# EAGLE schematic STELLA_RF (EAGLE 9.6.2)
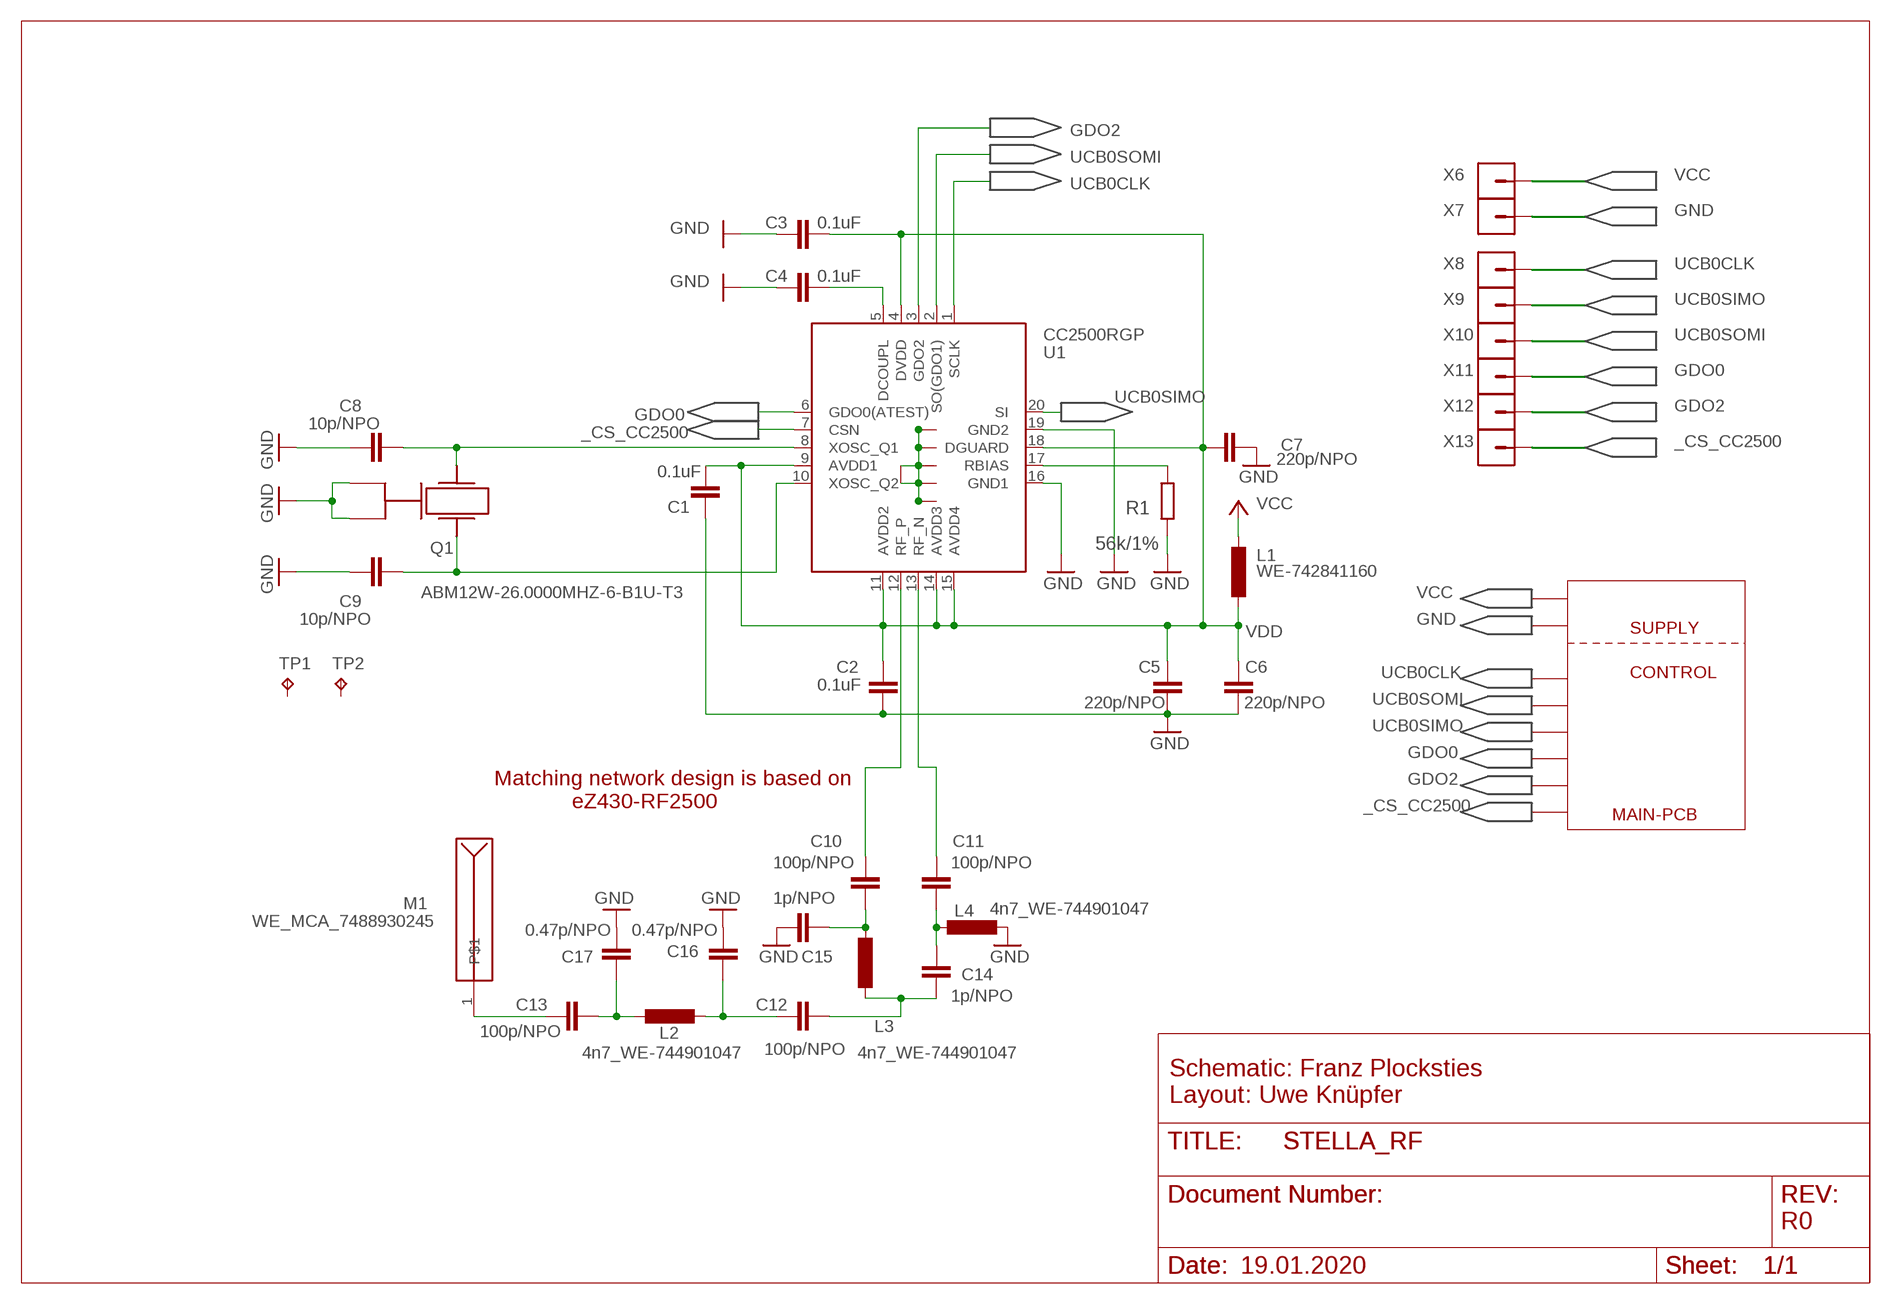
[diagram p0: schematic, sheet 1]

## Parts
C1  0.1uF  C-EUC0402  [C0402]
C2  0.1uF  C-EUC0402  [C0402]
C3  0.1uF  C-EUC0402  [C0402]
C4  0.1uF  C-EUC0402  [C0402]
C5  220p/NPO  C-EUC0402  [C0402]
C6  220p/NPO  C-EUC0402  [C0402]
C7  220p/NPO  C-EUC0402  [C0402]
C8  10p/NPO  C-EUC0402  [C0402]
C9  10p/NPO  C-EUC0402  [C0402]
C10  100p/NPO  C-EUC0402  [C0402]
C11  100p/NPO  C-EUC0402  [C0402]
C12  100p/NPO  C-EUC0402  [C0402]
C13  100p/NPO  C-EUC0402  [C0402]
C14  1p/NPO  C-EUC0402  [C0402]
C15  1p/NPO  C-EUC0402  [C0402]
C16  0.47p/NPO  C-EUC0402  [C0402]
C17  0.47p/NPO  C-EUC0402  [C0402]
L1  WE-742841160  L-EU  [L0402]
L2  4n7_WE-744901047  L-EU  [L0402]
L3  4n7_WE-744901047  L-EU  [L0402]
L4  4n7_WE-744901047  L-EU  [L0402]
M1  WE_MCA_7488930245  [WE_MCA_7488930245]
Q1  ABM12W-26.0000MHZ-6-B1U-T3  ABM12W  [ABM12W]
R1  56k/1%  R-EU_R0402  [R0402]
TP1  TPTP06SQ  [TP06SQ]
TP2  TPTP06SQ  [TP06SQ]
U1  CC2500RGP  CHIPCON_CC1100  [CHIPCON_QLP20]
X6  1PIN_INTERFACE  [1PIN_INTERFACE]
X7  1PIN_INTERFACE  [1PIN_INTERFACE]
X8  1PIN_INTERFACE  [1PIN_INTERFACE]
X9  1PIN_INTERFACE  [1PIN_INTERFACE]
X10  1PIN_INTERFACE  [1PIN_INTERFACE]
X11  1PIN_INTERFACE  [1PIN_INTERFACE]
X12  1PIN_INTERFACE  [1PIN_INTERFACE]
X13  1PIN_INTERFACE  [1PIN_INTERFACE]

## Nets
_CS_CC2500: U1.7(CSN) X13.1
GDO0: U1.6(GDO0(ATEST)) X11.1
GDO2: U1.3(GDO2) X12.1
GND: C1.1 C2.1 C3.1 C4.1 C5.1 C6.1 C7.2 C8.1 C9.1 C15.2 C16.2 C17.2 L4.1 Q1.2 Q1.4 R1.2 U1.16(GND1) U1.19(GND2) U1.EP U1.GND1(G1) U1.GND2(G2) U1.GND3(G3) U1.GND4(G4) U1.GND5(G5) X7.1
N$16: C4.2 U1.5(DCOUPL)
N$17: C13.1 M1.1
N$18: C8.2 Q1.1 U1.8(XOSC_Q1)
N$19: R1.1 U1.17(RBIAS)
N$20: C9.2 Q1.3 U1.10(XOSC_Q2)
N$22: C13.2 C17.1 L2.1
N$23: C12.2 C16.1 L2.2
N$24: C10.2 C15.1 L3.2
N$25: C12.1 C14.2 L3.1
N$26: C11.2 C14.1 L4.2
N$27: C10.1 U1.12(RF_P)
N$28: C11.1 U1.13(RF_N)
UCB0CLK: U1.1(SCLK) X8.1
UCB0SIMO: U1.20(SI) X9.1
UCB0SOMI: U1.2(SO(GDO1)) X10.1
VCC: L1.1 X6.1
VDD: C1.2 C2.2 C3.2 C5.2 C6.2 C7.1 L1.2 U1.4(DVDD) U1.9(AVDD1) U1.11(AVDD2) U1.14(AVDD3) U1.15(AVDD4) U1.18(DGUARD)
Unconnected: TP1.TP TP2.TP

## Notes on the sheet
- X6
- X7
- X8
- X9
- X10
- X11
- X12
- X13
- VCC
- GND
- SUPPLY
- CONTROL
- MAIN-PCB
- Matching network design is based on 
               eZ430-RF2500
- M1
- WE_MCA_7488930245
- Schematic: Franz Plocksties 
  Layout: Uwe Knüpfer
- R0
- 19.01.2020

## Library data of the parts
C1-C17 = UKN_rcl:C-EU: CAPACITOR, European symbol
L1-L4 = UKN_rcl:L-EU: INDUCTOR, European symbol
M1 = antennas:WE_MCA_7488930245
Q1 = ABM12W:ABM12W
R1 = UKN_rcl:R-EU_: RESISTOR, European symbol
TP1 TP2 = testpad:TP: Test pad
U1 = eZ430-RF2500T_HW-V1.0_20070403:CHIPCON_CC1100
X6-X13 = stella2.1_bilateral_MainPCB:1PIN_INTERFACE

## Net classes
0 default: width 0.25 mm
1 GND: width 0.4 mm
2 VCC: width 0.4 mm